# EAGLE design PSIO Switchboard PU-22 v1 (EAGLE 9.6.2)
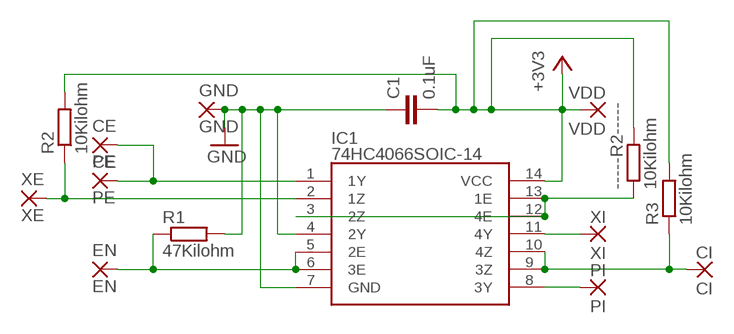
[diagram p0: schematic, sheet 1]

## Parts
-----R2-----  10Kilohm  RESISTORSR0805  [R0805]
C1  0.1uF  CAPACITORSC0805  [C0805]
CE  CE  PADSCIRCLE-2X2  [CIRCLE-2X2]
CI  CI  PADSCIRCLE-2X2  [CIRCLE-2X2]
EN  EN  PADSCIRCLE-2X2  [CIRCLE-2X2]
GND  GND  PADSCIRCLE-2X2  [CIRCLE-2X2]
IC1  74HC4066SOIC-14  [SOIC-14]
PE  PE  PADSCIRCLE-2X2  [CIRCLE-2X2]
PI  PI  PADSCIRCLE-2X2  [CIRCLE-2X2]
R1  47Kilohm  RESISTORSR0805  [R0805]
R2  10Kilohm  RESISTORSR0805  [R0805]
R3  10Kilohm  RESISTORSR0805  [R0805]
VDD  VDD  PADSCIRCLE-2X2  [CIRCLE-2X2]
XE  XE  PADSCIRCLE-2X2  [CIRCLE-2X2]
XI  XI  PADSCIRCLE-2X2  [CIRCLE-2X2]

## Nets
+3V3: -----R2-----.2 C1.2 IC1.14(VCC) R2.2 R3.2 VDD.1(P)
CI: CI.1(P) IC1.9(3Z) IC1.10(4Z) R3.1
EN: EN.1(P) IC1.5(2E) IC1.6(3E) R1.1
GND: C1.1 GND.1(P) IC1.4(2Y) IC1.7(GND) R1.2
N$1: -----R2-----.1 IC1.3(2Z) IC1.12(4E) IC1.13(1E)
PE-CE: CE.1(P) IC1.1(1Y) PE.1(P)
PI: IC1.8(3Y) PI.1(P)
XE: IC1.2(1Z) R2.1 XE.1(P)
XI: IC1.11(4Y) XI.1(P)

## Library data of the parts
-----R2----- R1-R3 = Consoles Unleashed Eagle Parts Library:RESISTORS: Resistors
C1 = Consoles Unleashed Eagle Parts Library:CAPACITORS: Capacitors
CE CI EN GND PE PI VDD XE XI = Consoles Unleashed Eagle Parts Library:PADS: PADS to connect wires to PCB
IC1 = Consoles Unleashed Eagle Parts Library:74HC4066: 74HC4066 quad SPST analog switch.

## Board
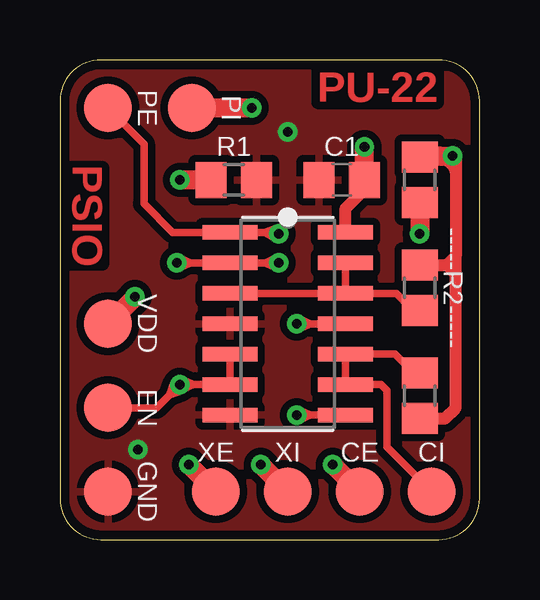
[diagram p1: board, top side]
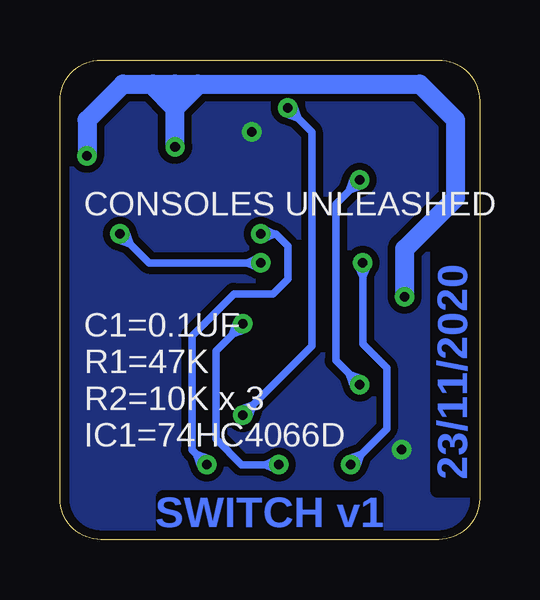
[diagram p2: board, bottom side, seen from below]

Size 17.5 x 20 mm. Coordinates in mm from the lower left corner, seen from the top.
Outline: 17.5,1.71 17.5,18.29 arc90 15.79,20 1.71,20 arc90 0,18.29 0,1.71 arc90 1.71,0 15.79,0 arc90 17.5,1.71
Copper layers (1*16): Top 0.035559375mm / dielectric 1.6mm / Bottom 0.035559375mm
Design rules "oshpark-2layer *": minimum track width 6mil, minimum drill 10mil, track to track 6mil, track to pad 6mil, pad to pad 6mil, via to via 6mil, smd to smd 6mil, copper to edge 15mil, drill to drill 6mil, minimum pad ring 5mil, minimum via ring 5mil, stop-mask expansion 2.5mil, vias tented up to drill 1mm, thermal gap 12mil

### Footprints (pad centres in the part's own frame; a part is rotated, then mirrored left to right if it is on the bottom)
R0805 = smd 1.3 x 1.5: 1 -0.95,0; 2 0.95,0
C0805 = smd 1.3 x 1.5: 1 -0.95,0; 2 0.95,0
CIRCLE-2X2 = smd 2 x 2: 1 0,0
SOIC-14 = smd 2.286 x 0.61: 1 -2.413,3.81; 2 -2.413,2.54; 3 -2.413,1.27; 4 -2.413,0; 5 -2.413,-1.27; 6 -2.413,-2.54; 7 -2.413,-3.81; 8 2.413,-3.81; 9 2.413,-2.54; 10 2.413,-1.27; 11 2.413,0; 12 2.413,1.27; 13 2.413,2.54; 14 2.413,3.81

### Placement (x,y rotation side)
-----R2-----  15,10.5 90 top
C1  11.75,15 0 top
CE  12.5,2 0 top
CI  15.5,2 0 top
EN  2,5.5 0 top
GND  2,2 0 top
IC1  9.5,9 0 top
PE  2,18 0 top
PI  5.5,18 0 top
R1  7.25,15 0 top
R2  15,15 90 top
R3  15,6 270 top
VDD  2,9 0 top
XE  6.5,2 0 top
XI  9.5,2 0 top

### Tracks (layer width: path | path; a pad name or v marks a point on that pad's centre or on a via)
+3V3  (via drill 0.4 pad 0.8)
  Top 0.305: 15.84,16 16.5,15.34 | 16.43,15.4 16.61,15.92 v16.38,16 16.16,15.88 16.43,15.4
  Top 0.508: -----R2-----.2 16.12,11.45 | IC1.14 11.91,13.81 12.7,14.6 C1.2 | R3.2 16.05,5.05 16.5,5.5 16.5,11.12 | 16.5,11.12 16.5,11.82 | R2.2 15.05,16 | v16.38,16 16.5,15.88 16.5,15.34 16.5,11.82 | 16.5,11.82 16.12,11.45 | 16.12,11.45 16.45,11.12 16.5,11.12 | v16.38,16 16.52,15.99 16.5,15.41 16.24,15.94 v16.38,16
  Top 0.8: 15.05,16 15.84,16 v16.38,16 | v3.12,10.12 VDD.1 | C1.2 v12.7,16.38
  Bottom 0.8: v3.12,10.12 3.12,12.12 1,14.25 1,17.5 2.5,19 11.75,19 | 12.7,19 11.75,19 | v16.38,16 16.38,17.5 14.88,19 13.62,19 | v12.7,16.38 12.7,18 | 12.7,19 12.7,18 | 13.62,19 12.7,19 | 12.7,18 13.62,18.93 13.62,19 | 12.7,18 11.75,18.95 11.75,19
CI
  Top 0.305: CI.1 13.62,3.88 13.62,6.21 13.38,6.46 IC1.9 IC1.10 13.97,7.73 14.75,6.95 R3.1
EN  (via drill 0.4 pad 0.8)
  Top 0.305: IC1.5 IC1.6 v5,6.46 | v5,6.46 4.04,5.5 EN.1 | v5,6.46 5.09,6.23 4.58,6.04 4.77,6.55 v5,6.46 | v5,6.46 5.1,6.69 5.6,6.46 5.1,6.23 v5,6.46
  Top 0.8: R1.1 v5,15
  Bottom 0.305: v5,15 6,14 6,7.46 v5,6.46 | v5,6.46 4.91,6.69 5.42,6.88 5.23,6.37 v5,6.46 | v5,15 5.23,15.09 5.42,14.58 4.91,14.77 v5,15
GND  (via drill 0.4 pad 0.8)
  Top 0.305: IC1.7 6.19,5.19
  other vias: 9.5,17 3.25,3.75
  pour Bottom (isolate 0.305): 15.79,0 1.71,0 arc-90 0,1.71 0,18.29 arc-90 1.71,20 15.79,20 arc-90 17.5,18.29 17.5,1.71 arc-90
  pour Top (isolate 0.305): 15.79,0 1.71,0 arc-90 0,1.71 0,18.29 arc-90 1.71,20 15.79,20 arc-90 17.5,18.29 17.5,1.71 arc-90
N$1
  Top 0.305: IC1.3 IC1.12 | IC1.12 IC1.13 | IC1.12 14.03,10.27 14.75,9.55 -----R2-----.1
PE-CE  (via drill 0.4 pad 0.8)
  Top 0.305: v9.12,12.75 9.06,12.81 IC1.1 4.69,12.81 3.5,14 3.5,16.5 PE.1 | v9.12,12.75 9,12.54 8.53,12.81 9.05,12.98 v9.12,12.75
  Top 0.8: CE.1 v11.38,3.12
  Bottom 0.305: v11.38,3.12 12,3.75 12,8.5 10.25,10.25 8.62,10.25 8,10.88 8,12.25 8.5,12.75 v9.12,12.75 | v9.12,12.75 9.02,12.52 8.53,12.75 9.02,12.98 v9.12,12.75 | v11.38,3.12 11.29,3.36 11.8,3.55 11.61,3.04 v11.38,3.12
PI  (via drill 0.4 pad 0.8)
  Top 0.305: v9.88,5.19 IC1.8 | v9.88,5.19 9.98,5.42 10.47,5.19 9.98,4.96 v9.88,5.19
  Top 0.8: v8,18 PI.1
  Bottom 0.305: v9.88,5.19 7,8.06 7,17 v8,18 | v8,18 8.09,17.77 7.58,17.58 7.77,18.09 v8,18 | v9.88,5.19 9.64,5.1 9.45,5.61 9.96,5.42 v9.88,5.19
XE  (via drill 0.4 pad 0.8)
  Top 0.305: v9.12,11.54 IC1.2 v4.88,11.54 | v9.12,11.54 9.02,11.31 8.53,11.54 9.02,11.77 v9.12,11.54 | v4.88,11.54 4.98,11.77 5.47,11.54 4.98,11.31 v4.88,11.54
  Top 0.8: R2.1 v15,12.75 | XE.1 v5.38,3.12
  Bottom 0.305: v15,12.75 13.79,11.54 v9.12,11.54 | v5.38,3.12 3.88,4.62 3.88,7.17 4.88,8.16 v4.88,11.54 | v9.12,11.54 9.23,11.77 9.72,11.54 9.23,11.31 v9.12,11.54 | v15,12.75 15.09,12.52 14.58,12.33 14.77,12.84 v15,12.75 | v5.38,3.12 5.14,3.04 4.95,3.55 5.46,3.36 v5.38,3.12 | v4.88,11.54 5.1,11.44 4.88,10.94 4.65,11.44 v4.88,11.54
XI  (via drill 0.4 pad 0.8)
  Top 0.305: IC1.11 v9.88,9 | v9.88,9 9.98,9.23 10.47,9 9.98,8.77 v9.88,9
  Top 0.8: XI.1 v8.38,3.12
  Bottom 0.305: v8.38,3.12 9.93,3.12 11,4.19 11,7.88 v9.88,9 | v8.38,3.12 8.48,3.35 8.97,3.12 8.48,2.9 v8.38,3.12 | v9.88,9 10.11,9.09 10.3,8.58 9.79,8.77 v9.88,9

### Text on the board
Top: PU-22 | PSIO
Bottom: 23/11/2020 | SWITCH v1
bNames: CONSOLES UNLEASHED | C1=0.1UF / R1=47K / R2=10K x 3 / IC1=74HC4066D